# EAGLE schematic DRM-X_voice(control) (EAGLE 7.4.0)
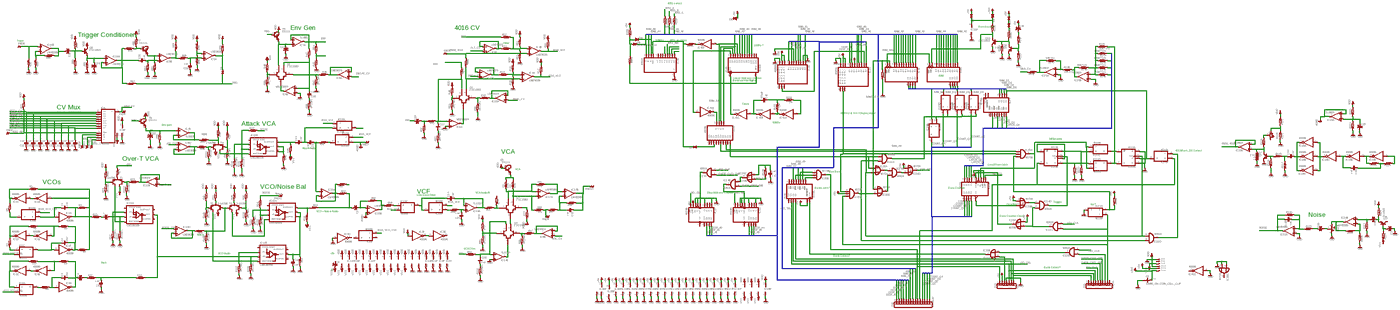
[diagram p0: schematic, sheet 1, overview]
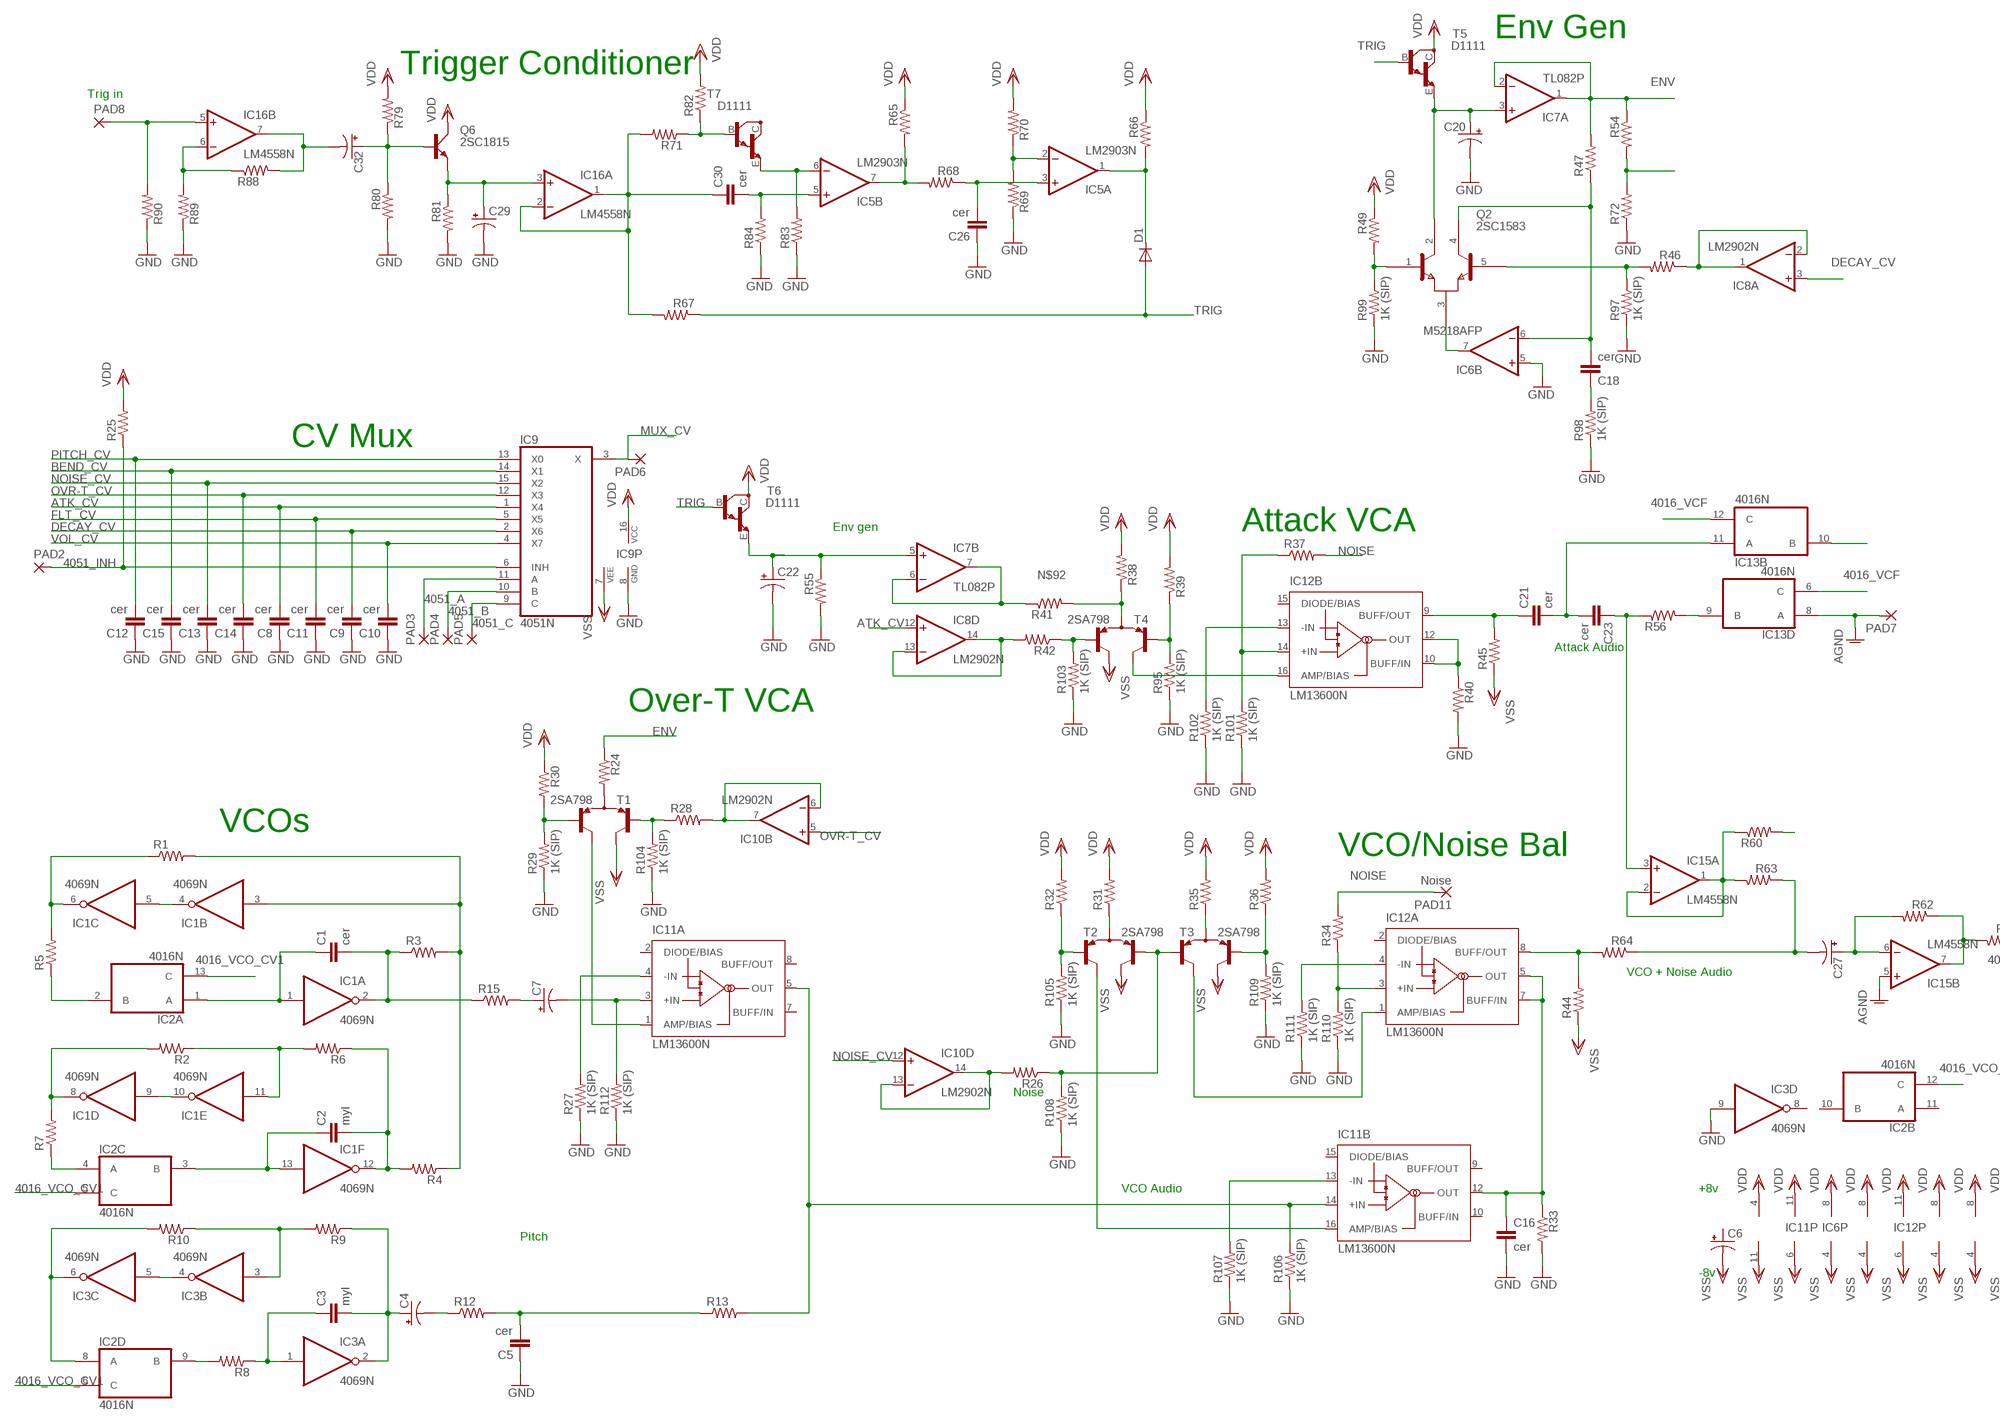
[diagram p1: schematic, sheet 1, part 1 of 4]
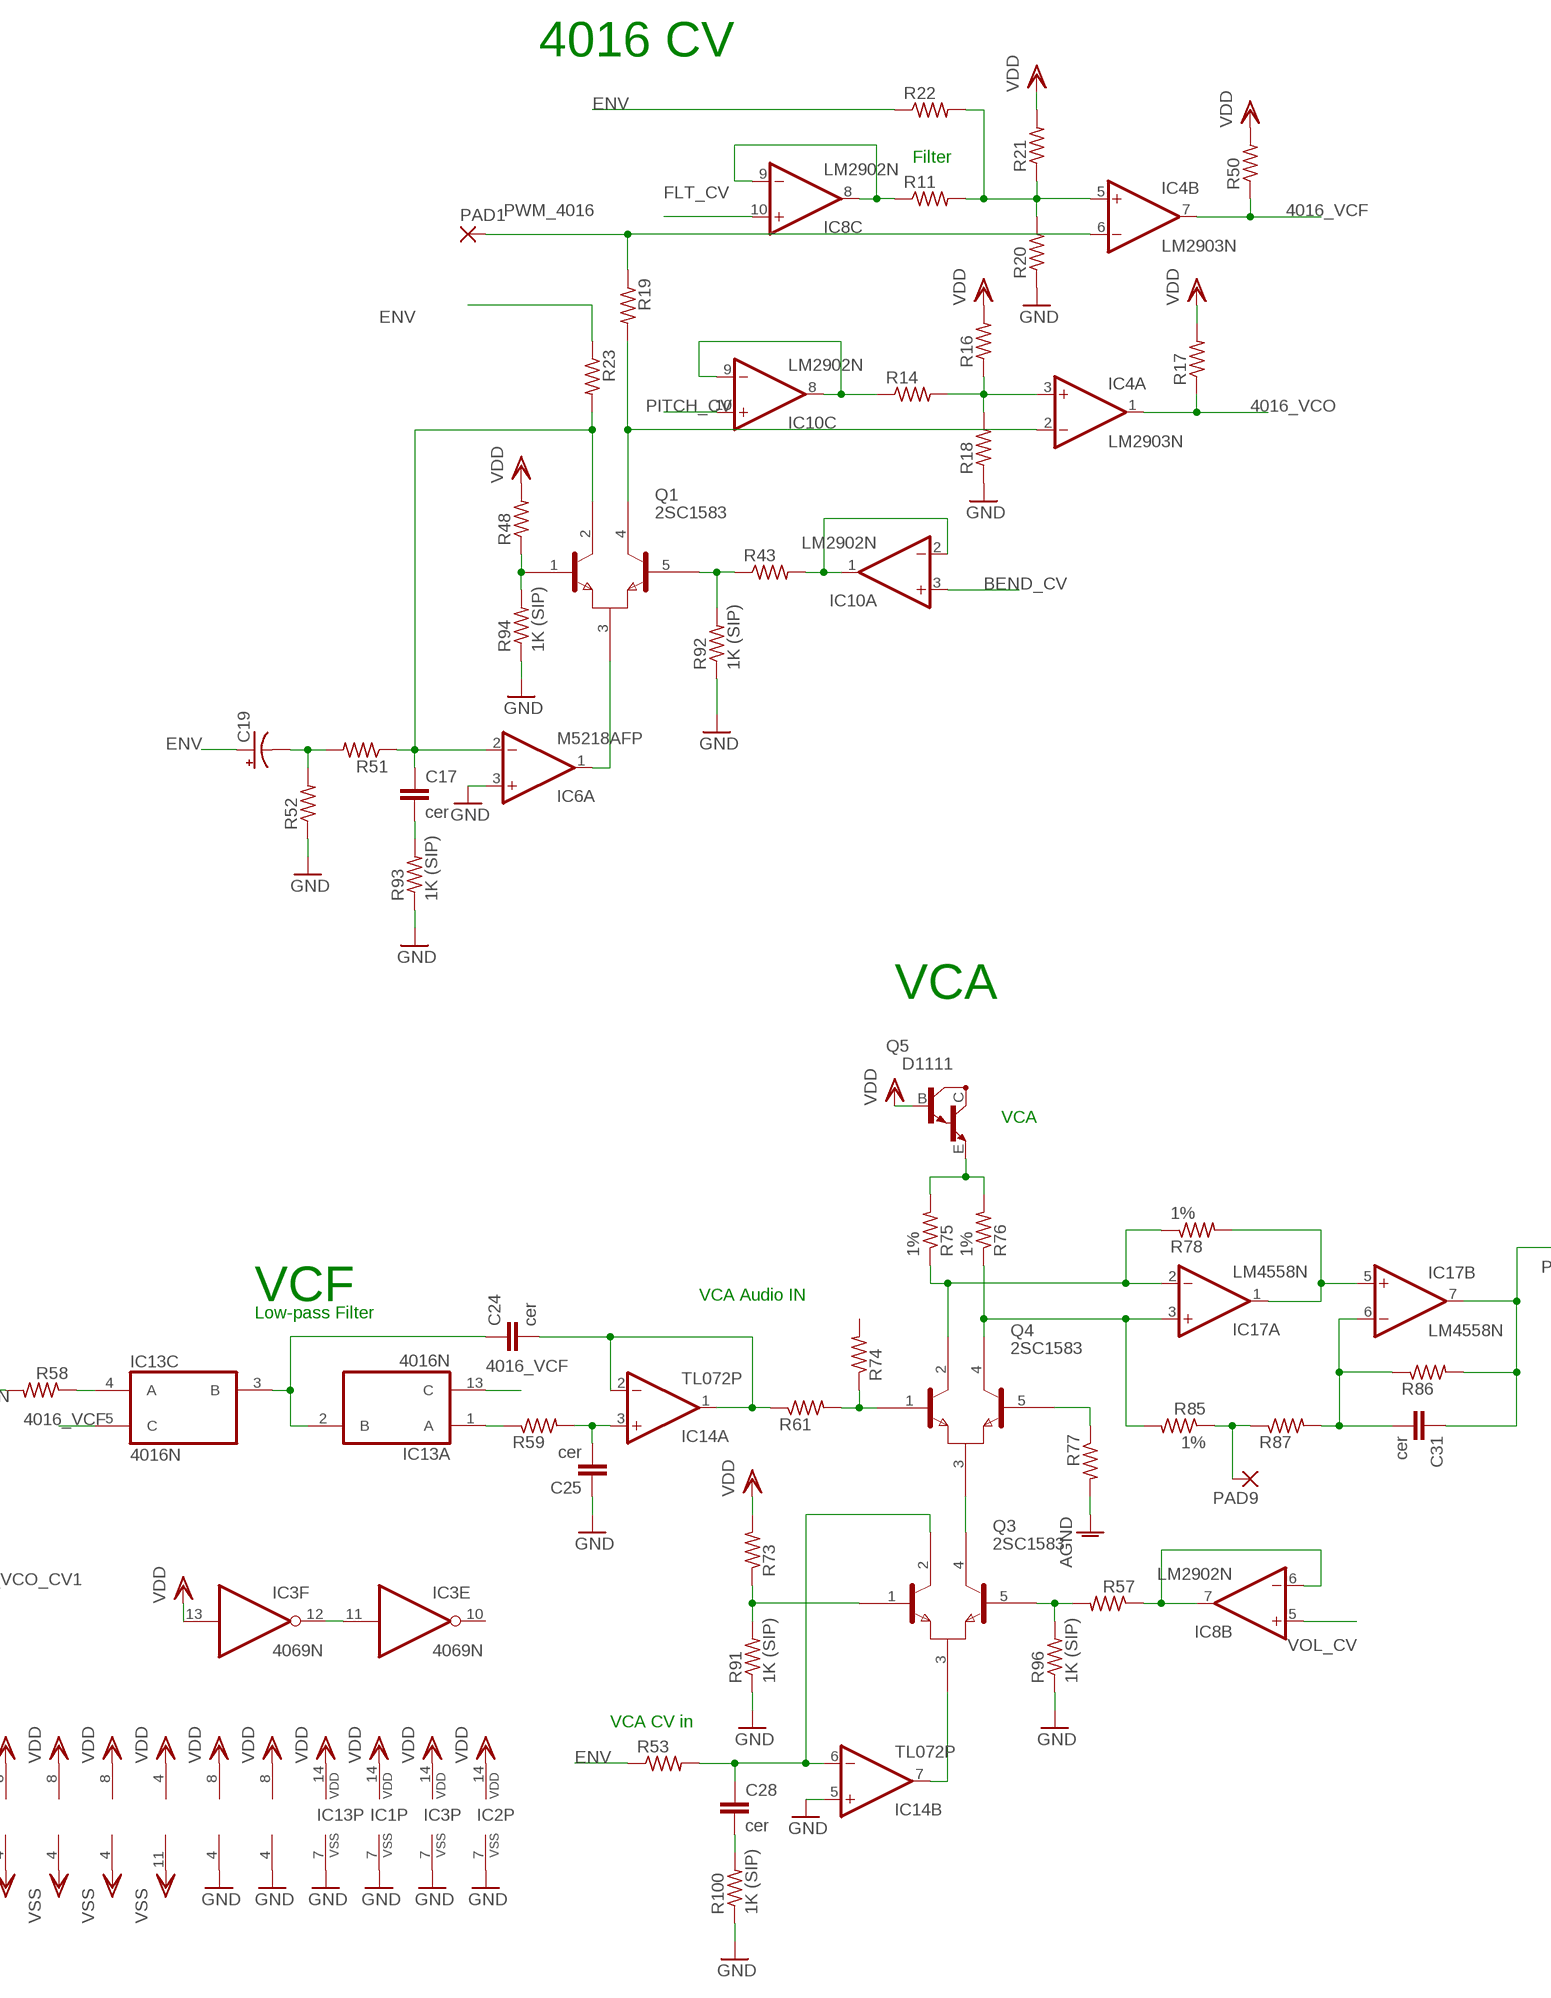
[diagram p2: schematic, sheet 1, part 2 of 4]
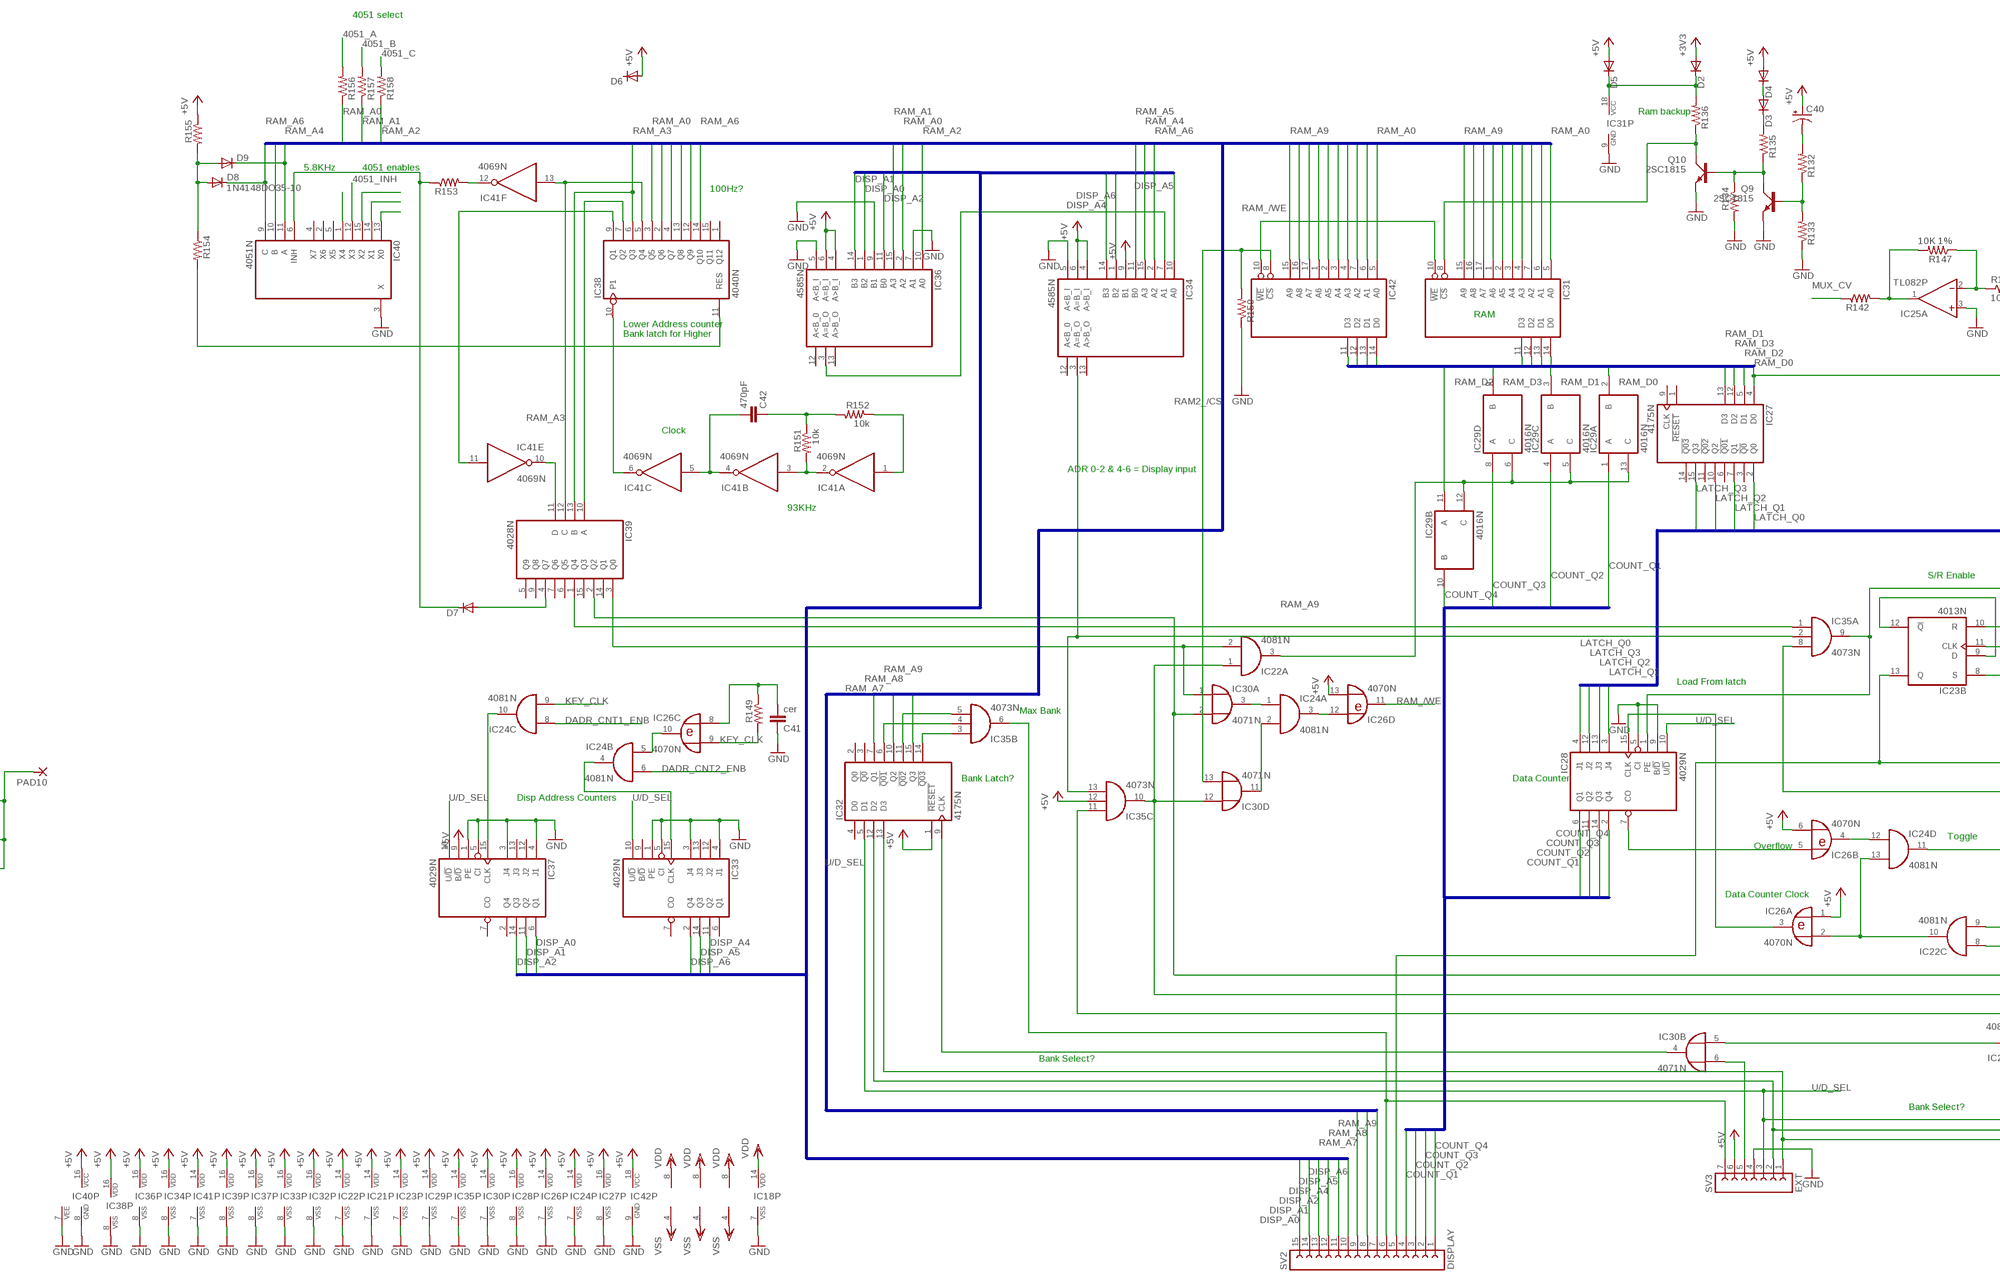
[diagram p3: schematic, sheet 1, part 3 of 4]
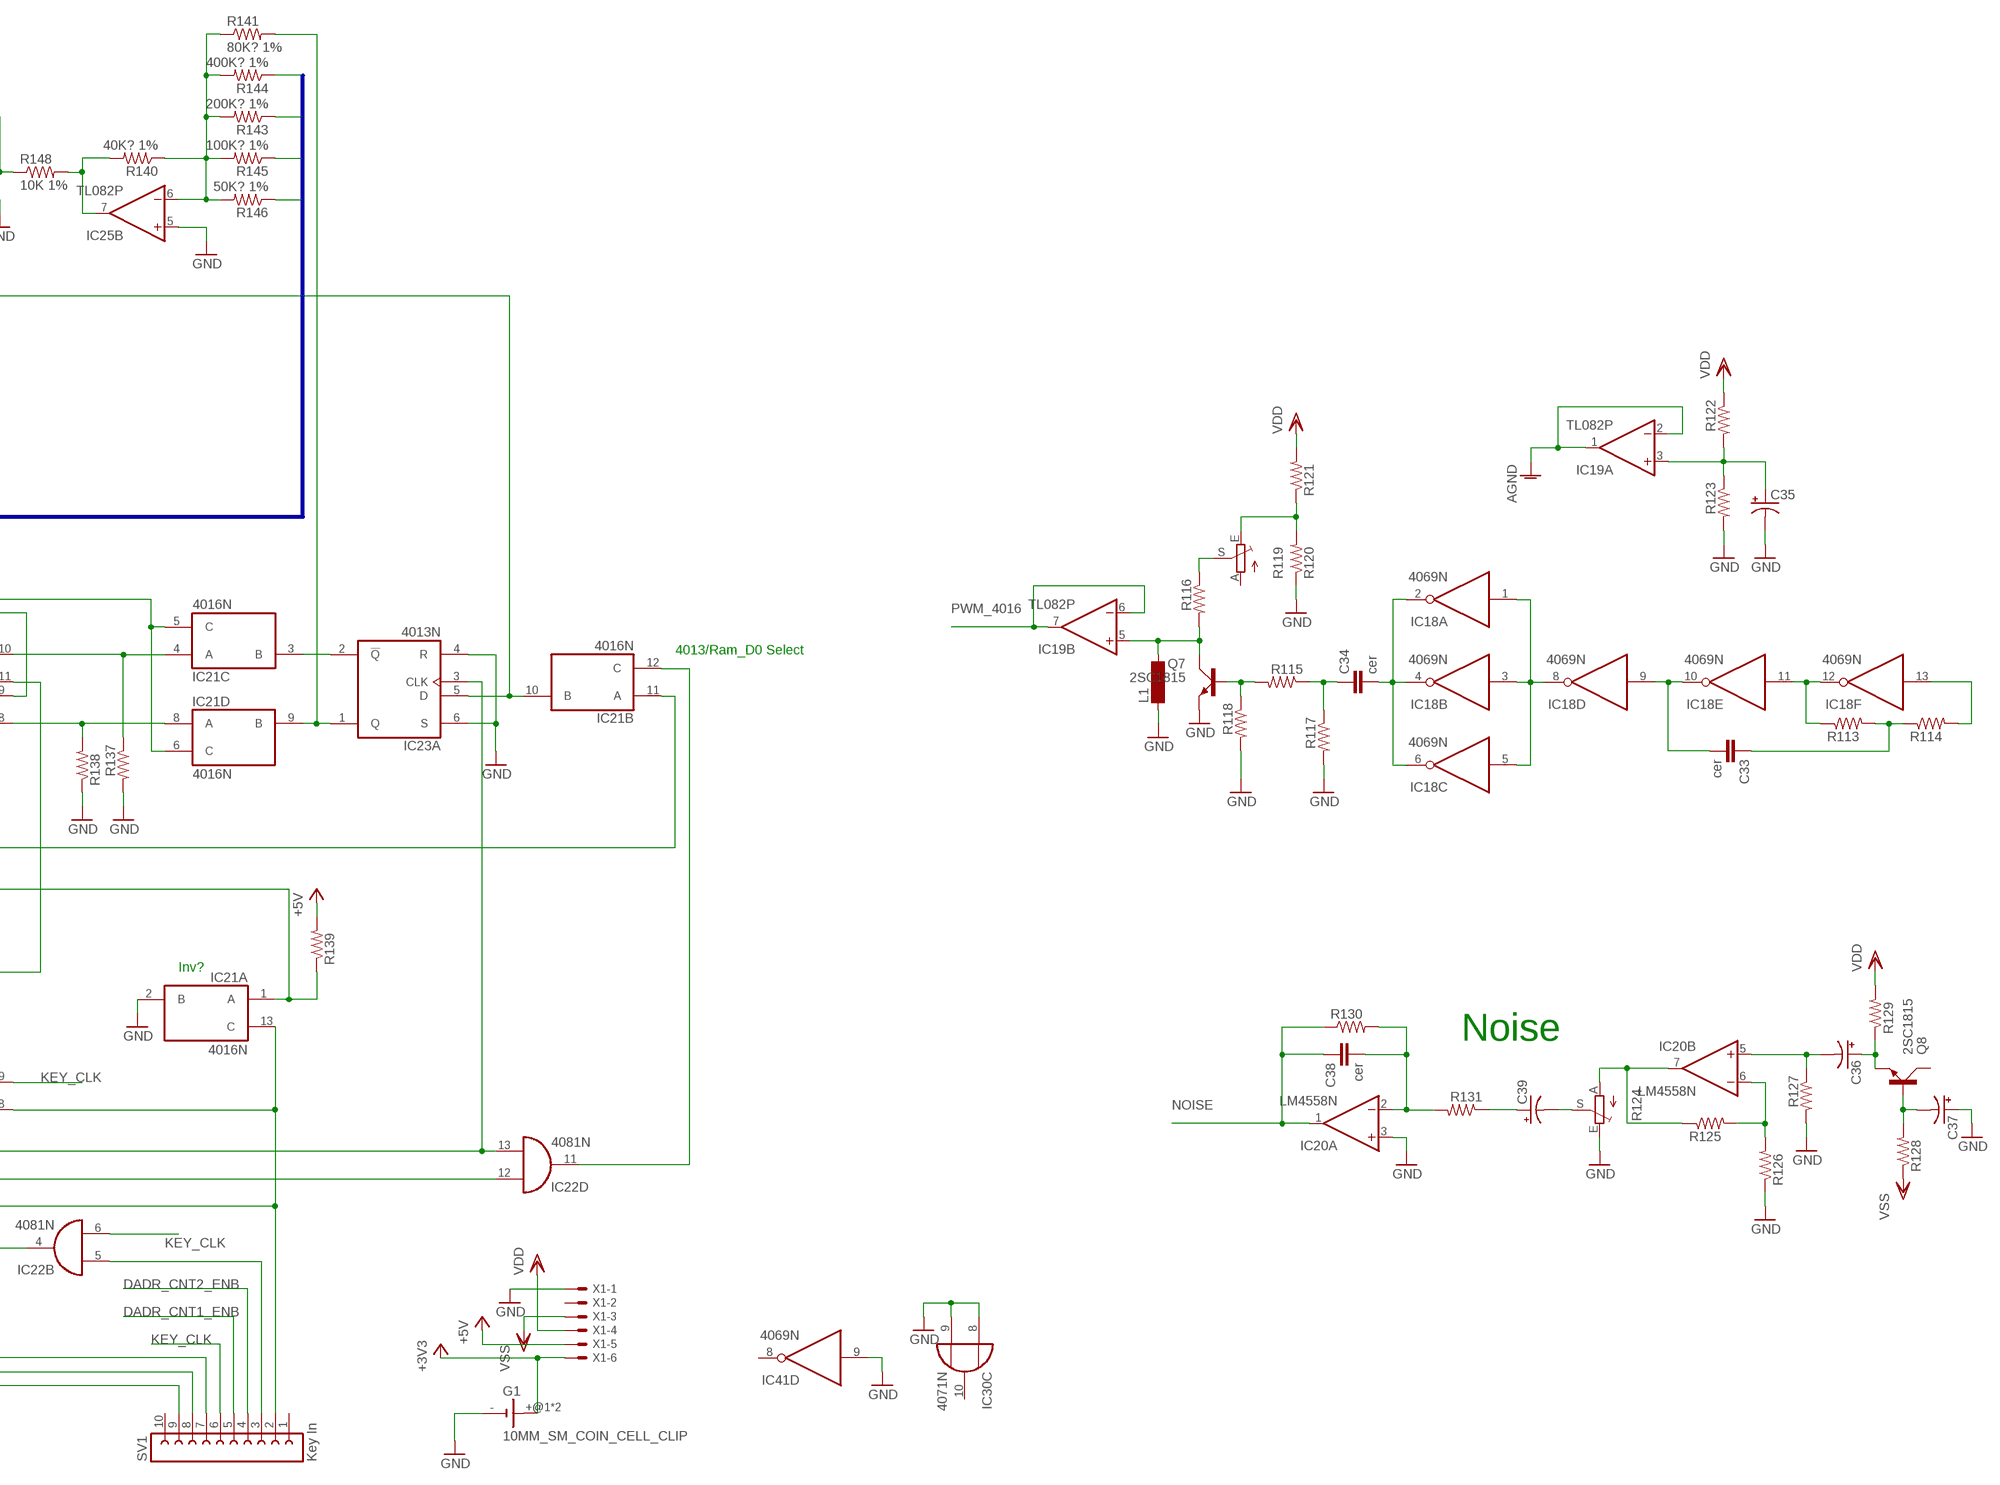
[diagram p4: schematic, sheet 1, part 4 of 4]

## Parts
C1  cer  C-EU025-025X050  [C025-025X050]
C2  myl  C-EU025-024X044  [C025-024X044]
C3  myl  C-EU025-024X044  [C025-024X044]
C4  CPOL-USE2.5-5  [E2,5-5]
C5  cer  C-EU025-025X050  [C025-025X050]
C6  CPOL-USE2.5-7  [E2,5-7]
C7  CPOL-USE2.5-5  [E2,5-5]
C8  cer  C-EU025-025X050  [C025-025X050]
C9  cer  C-EU025-025X050  [C025-025X050]
C10  cer  C-EU025-025X050  [C025-025X050]
C11  cer  C-EU025-025X050  [C025-025X050]
C12  cer  C-EU025-025X050  [C025-025X050]
C13  cer  C-EU025-025X050  [C025-025X050]
C14  cer  C-EU025-025X050  [C025-025X050]
C15  cer  C-EU025-025X050  [C025-025X050]
C16  cer  C-EU025-025X050  [C025-025X050]
C17  cer  C-EU025-025X050  [C025-025X050]
C18  cer  C-EU025-025X050  [C025-025X050]
C19  CPOL-USE2.5-5  [E2,5-5]
C20  CPOL-USE2.5-5  [E2,5-5]
C21  cer  C-EU025-025X050  [C025-025X050]
C22  CPOL-USE2.5-5  [E2,5-5]
C23  cer  C-EU025-025X050  [C025-025X050]
C24  cer  C-EU025-025X050  [C025-025X050]
C25  cer  C-EU025-025X050  [C025-025X050]
C26  cer  C-EU025-025X050  [C025-025X050]
C27  CPOL-USE2.5-5  [E2,5-5]
C28  cer  C-EU025-025X050  [C025-025X050]
C29  CPOL-USE2.5-5  [E2,5-5]
C30  cer  C-EU025-025X050  [C025-025X050]
C31  cer  C-EU025-025X050  [C025-025X050]
C32  CPOL-USE2.5-5  [E2,5-5]
C33  cer  C-EU025-025X050  [C025-025X050]
C34  cer  C-EU025-025X050  [C025-025X050]
C35  CPOL-USE2.5-5  [E2,5-5]
C36  CPOL-USE2.5-5  [E2,5-5]
C37  CPOL-USE2.5-5  [E2,5-5]
C38  cer  C-EU025-025X050  [C025-025X050]
C39  CPOL-USE2.5-5  [E2,5-5]
C40  CPOL-USE2.5-5  [E2,5-5]
C41  cer  C-EU025-025X050  [C025-025X050]
C42  470pF  C-EU025-025X050  [C025-025X050]
D1  DIODE-D-5  [D-5]
D2  DIODE-D-5  [D-5]
D3  DIODE-D-5  [D-5]
D4  DIODE-D-5  [D-5]
D5  DIODE-D-5  [D-5]
D6  DIODE-D-5  [D-5]
D7  DIODE-D-5  [D-5]
D8  1N4148DO35-10  [DO35-10]
D9  DIODE-D-5  [D-5]
G1  10MM_SM_COIN_CELL_CLIP  [10MM_SM_COIN_CELL_CLIP]
IC1  4069N  [DIL14]
IC2  4016N  [DIL14]
IC3  4069N  [DIL14]
IC4  LM2903N  [DIL08]
IC5  LM2903N  [DIL08]
IC6  M5218AFP  [SOP8]
IC7  TL082P  [DIL08]
IC8  LM2902N  [DIL14]
IC9  4051N  [DIL16]
IC10  LM2902N  [DIL14]
IC11  LM13600N  [DIL16]
IC12  LM13600N  [DIL16]
IC13  4016N  [DIL14]
IC14  TL072P  [DIL08]
IC15  LM4558N  [DIL08]
IC16  LM4558N  [DIL08]
IC17  LM4558N  [DIL08]
IC18  4069N  [DIL14]
IC19  TL082P  [DIL08]
IC20  LM4558N  [DIL08]
IC21  4016N  [DIL14]
IC22  4081N  [DIL14]
IC23  4013N  [DIL14]
IC24  4081N  [DIL14]
IC25  TL082P  [DIL08]
IC26  4070N  [DIL14]
IC27  4175N  [DIL16]
IC28  4029N  [DIL16]
IC29  4016N  [DIL14]
IC30  4071N  [DIL14]
IC31  2114  [DIL18]
IC32  4175N  [DIL16]
IC33  4029N  [DIL16]
IC34  4585N  [DIL16]
IC35  4073N  [DIL14]
IC36  4585N  [DIL16]
IC37  4029N  [DIL16]
IC38  4040N  [DIL16]
IC39  4028N  [DIL16]
IC40  4051N  [DIL16]
IC41  4069N  [DIL14]
IC42  2114  [DIL18]
L1  SD75  [SD75]
PAD1  2,0/0,9-O  [2,0/0,9-O]
PAD2  2,0/0,9-O  [2,0/0,9-O]
PAD3  2,0/0,9-O  [2,0/0,9-O]
PAD4  2,0/0,9-O  [2,0/0,9-O]
PAD5  2,0/0,9-O  [2,0/0,9-O]
PAD6  2,0/0,9-O  [2,0/0,9-O]
PAD7  2,0/0,9-O  [2,0/0,9-O]
PAD8  2,0/0,9-O  [2,0/0,9-O]
PAD9  2,0/0,9-O  [2,0/0,9-O]
PAD10  2,0/0,9-O  [2,0/0,9-O]
PAD11  Noise  2,0/0,9-O  [2,0/0,9-O]
Q1  2SC1583  [XSIST_SIP5]
Q2  2SC1583  [XSIST_SIP5]
Q3  2SC1583  [XSIST_SIP5]
Q4  2SC1583  [XSIST_SIP5]
Q5  D1111  BC517D1111-ECB  [TO92-ECB]
Q6  2SC1815  [TO92-LINE]
Q7  2SC1815  [TO92-LINE]
Q8  2SC1815  [TO92-LINE]
Q9  2SC1815  [TO92-LINE]
Q10  2SC1815  [TO92-LINE]
R1  R-US_0204/7  [0204/7]
R2  R-US_0204/7  [0204/7]
R3  R-US_0204/7  [0204/7]
R4  R-US_0204/7  [0204/7]
R5  R-US_0204/7  [0204/7]
R6  R-US_0204/7  [0204/7]
R7  R-US_0204/7  [0204/7]
R8  R-US_0204/7  [0204/7]
R9  R-US_0204/7  [0204/7]
R10  R-US_0204/7  [0204/7]
R11  R-US_0204/7  [0204/7]
R12  R-US_0204/7  [0204/7]
R13  R-US_0204/7  [0204/7]
R14  R-US_0204/7  [0204/7]
R15  R-US_0204/7  [0204/7]
R16  R-US_0204/7  [0204/7]
R17  R-US_0204/7  [0204/7]
R18  R-US_0204/7  [0204/7]
R19  R-US_0204/7  [0204/7]
R20  R-US_0204/7  [0204/7]
R21  R-US_0204/7  [0204/7]
R22  R-US_0204/7  [0204/7]
R23  R-US_0204/7  [0204/7]
R24  R-US_0204/7  [0204/7]
R25  R-US_0204/7  [0204/7]
R26  R-US_0204/7  [0204/7]
R27  1K (SIP)  R-US_0204/7  [0204/7]
R28  R-US_0204/7  [0204/7]
R29  1K (SIP)  R-US_0204/7  [0204/7]
R30  R-US_0204/7  [0204/7]
R31  R-US_0204/7  [0204/7]
R32  R-US_0204/7  [0204/7]
R33  R-US_0204/7  [0204/7]
R34  R-US_0204/7  [0204/7]
R35  R-US_0204/7  [0204/7]
R36  R-US_0204/7  [0204/7]
R37  R-US_0204/7  [0204/7]
R38  R-US_0204/7  [0204/7]
R39  R-US_0204/7  [0204/7]
R40  R-US_0204/7  [0204/7]
R41  R-US_0204/7  [0204/7]
R42  R-US_0204/7  [0204/7]
R43  R-US_0204/7  [0204/7]
R44  R-US_0204/7  [0204/7]
R45  R-US_0204/7  [0204/7]
R46  R-US_0204/7  [0204/7]
R47  R-US_0204/7  [0204/7]
R48  R-US_0204/7  [0204/7]
R49  R-US_0204/7  [0204/7]
R50  R-US_0204/7  [0204/7]
R51  R-US_0204/7  [0204/7]
R52  R-US_0204/7  [0204/7]
R53  R-US_0204/7  [0204/7]
R54  R-US_0204/7  [0204/7]
R55  R-US_0204/7  [0204/7]
R56  R-US_0204/7  [0204/7]
R57  R-US_0204/7  [0204/7]
R58  R-US_0204/7  [0204/7]
R59  R-US_0204/7  [0204/7]
R60  R-US_0204/7  [0204/7]
R61  R-US_0204/7  [0204/7]
R62  R-US_0204/7  [0204/7]
R63  R-US_0204/7  [0204/7]
R64  R-US_0204/7  [0204/7]
R65  R-US_0204/7  [0204/7]
R66  R-US_0204/7  [0204/7]
R67  R-US_0204/7  [0204/7]
R68  R-US_0204/7  [0204/7]
R69  R-US_0204/7  [0204/7]
R70  R-US_0204/7  [0204/7]
R71  R-US_0204/7  [0204/7]
R72  R-US_0204/7  [0204/7]
R73  R-US_0204/7  [0204/7]
R74  R-US_0204/7  [0204/7]
R75  1%  R-US_0204/7  [0204/7]
R76  1%  R-US_0204/7  [0204/7]
R77  R-US_0204/7  [0204/7]
R78  1%  R-US_0204/7  [0204/7]
R79  R-US_0204/7  [0204/7]
R80  R-US_0204/7  [0204/7]
R81  R-US_0204/7  [0204/7]
R82  R-US_0204/7  [0204/7]
R83  R-US_0204/7  [0204/7]
R84  R-US_0204/7  [0204/7]
R85  1%  R-US_0204/7  [0204/7]
R86  R-US_0204/7  [0204/7]
R87  R-US_0204/7  [0204/7]
R88  R-US_0204/7  [0204/7]
R89  R-US_0204/7  [0204/7]
R90  R-US_0204/7  [0204/7]
R91  1K (SIP)  R-US_0204/7  [0204/7]
R92  1K (SIP)  R-US_0204/7  [0204/7]
R93  1K (SIP)  R-US_0204/7  [0204/7]
R94  1K (SIP)  R-US_0204/7  [0204/7]
R95  1K (SIP)  R-US_0204/7  [0204/7]
R96  1K (SIP)  R-US_0204/7  [0204/7]
R97  1K (SIP)  R-US_0204/7  [0204/7]
R98  1K (SIP)  R-US_0204/7  [0204/7]
R99  1K (SIP)  R-US_0204/7  [0204/7]
R100  1K (SIP)  R-US_0204/7  [0204/7]
R101  1K (SIP)  R-US_0204/7  [0204/7]
R102  1K (SIP)  R-US_0204/7  [0204/7]
R103  1K (SIP)  R-US_0204/7  [0204/7]
R104  1K (SIP)  R-US_0204/7  [0204/7]
R105  1K (SIP)  R-US_0204/7  [0204/7]
R106  1K (SIP)  R-US_0204/7  [0204/7]
R107  1K (SIP)  R-US_0204/7  [0204/7]
R108  1K (SIP)  R-US_0204/7  [0204/7]
R109  1K (SIP)  R-US_0204/7  [0204/7]
R110  1K (SIP)  R-US_0204/7  [0204/7]
R111  1K (SIP)  R-US_0204/7  [0204/7]
R112  1K (SIP)  R-US_0204/7  [0204/7]
R113  R-US_0204/7  [0204/7]
R114  R-US_0204/7  [0204/7]
R115  R-US_0204/7  [0204/7]
R116  R-US_0204/7  [0204/7]
R117  R-US_0204/7  [0204/7]
R118  R-US_0204/7  [0204/7]
R119  TRIM_EU-CA6V  [CA6V]
R120  R-US_0204/7  [0204/7]
R121  R-US_0204/7  [0204/7]
R122  R-US_0204/7  [0204/7]
R123  R-US_0204/7  [0204/7]
R124  TRIM_EU-CA6V  [CA6V]
R125  R-US_0204/7  [0204/7]
R126  R-US_0204/7  [0204/7]
R127  R-US_0204/7  [0204/7]
R128  R-US_0204/7  [0204/7]
R129  R-US_0204/7  [0204/7]
R130  R-US_0204/7  [0204/7]
R131  R-US_0204/7  [0204/7]
R132  R-US_0204/7  [0204/7]
R133  R-US_0204/7  [0204/7]
R134  R-US_0204/7  [0204/7]
R135  R-US_0204/7  [0204/7]
R136  R-US_0204/7  [0204/7]
R137  R-US_0204/7  [0204/7]
R138  R-US_0204/7  [0204/7]
R139  R-US_0204/7  [0204/7]
R140  40K? 1%  R-US_0204/5  [0204/5]
R141  80K? 1%  R-US_0204/5  [0204/5]
R142  R-US_0204/7  [0204/7]
R143  200K? 1%  R-US_0204/5  [0204/5]
R144  400K? 1%  R-US_0204/5  [0204/5]
R145  100K? 1%  R-US_0204/5  [0204/5]
R146  50K? 1%  R-US_0204/5  [0204/5]
R147  10K 1%  R-US_0204/5  [0204/5]
R148  10K 1%  R-US_0204/5  [0204/5]
R149  R-US_0204/7  [0204/7]
R150  R-US_0204/7  [0204/7]
R151  10k  R-US_0204/7  [0204/7]
R152  10k  R-US_0204/7  [0204/7]
R153  R-US_0204/7  [0204/7]
R154  R-US_0204/2V  [0204V]
R155  R-US_0204/7  [0204/7]
R156  R-US_0204/7  [0204/7]
R157  R-US_0204/7  [0204/7]
R158  R-US_0204/7  [0204/7]
SV1  Key In  FE10-1  [FE10]
SV2  DISPLAY  FE15-1  [FE15]
SV3  EXT  FE07-1  [FE07]
T1  2SA798  [SIP-5]
T2  2SA798  [SIP-5]
T3  2SA798  [SIP-5]
T4  2SA798  [SIP-5]
T5  D1111  BC517D1111-ECB  [TO92-ECB]
T6  D1111  BC517D1111-ECB  [TO92-ECB]
T7  D1111  BC517D1111-ECB  [TO92-ECB]
X1  KK-156-6  [KK-156-6]

## Nets
4016_VCF: IC4.7(B:OUT) IC13.5(C:C) IC13.6(D:C) IC13.12(B:C) IC13.13(A:C) R50.1
4016_VCO: IC4.1(A:OUT) R17.1
4016_VCO_CV1: IC2.5(C:C) IC2.6(D:C) IC2.12(B:C) IC2.13(A:C)
4051_A: IC9.11(A) PAD3.1(P) R156.2
4051_B: IC9.10(B) PAD4.1(P) R157.2
4051_C: IC9.9(C) PAD5.1(P) R158.2
4051_INH: IC9.6(INH) IC40.12(X3) PAD2.1(P) R25.1
+3V3: D2.A G1.+@1(+) G1.+@2(+) X1.6
+5V: C40.+ D4.A D5.A D6.A IC21.14(P:VDD) IC22.14(P:VDD) IC23.14(P:VDD) IC24.14(P:VDD) IC26.1(A:I0) IC26.6(B:I1) IC26.13(D:I1) IC26.14(P:VDD) IC27.16(VDD) IC28.16(VDD) IC29.14(P:VDD) IC30.14(P:VDD) IC32.1(!RESET) IC32.16(VDD) IC33.16(VDD) IC34.4(A>B_I) IC34.6(A=B_I) IC34.9(B1) IC34.16(VDD) IC35.12(C:I1) IC35.14(P:VDD) IC36.4(A>B_I) IC36.6(A=B_I) IC36.16(VDD) IC37.9(B/!D) IC37.16(VDD) IC38.16(VDD) IC39.16(VDD) IC40.16(VCC) IC41.14(P:VDD) IC42.18(VCC) R139.2 R155.1 SV3.6 X1.5
AGND: IC13.8(D:A) IC15.5(B:+IN) IC19.1(A:OUT) IC19.2(A:-IN) PAD7.1(P) R77.2
ATK_CV: C8.2 IC8.12(D:+IN) IC9.1(X4)
BEND_CV: C15.2 IC9.14(X1) IC10.3(A:+IN)
COUNT_Q1: IC28.6(Q1) IC29.1(A:A) SV2.4
COUNT_Q2: IC28.11(Q2) IC29.4(C:A) SV2.3
COUNT_Q3: IC28.14(Q3) IC29.8(D:A) SV2.2
COUNT_Q4: IC28.2(Q4) IC29.10(B:B) SV2.1
DADR_CNT1_ENB: IC24.8(C:I0) SV1.5
DADR_CNT2_ENB: IC24.6(B:I1) SV1.4
DECAY_CV: C9.2 IC8.3(A:+IN) IC9.2(X6)
DISP_A0: IC36.1(B2) IC37.6(Q1) SV2.15
DISP_A1: IC36.14(B3) IC37.11(Q2) SV2.14
DISP_A2: IC36.11(B0) IC37.14(Q3) SV2.13
DISP_A4: IC33.11(Q2) IC34.14(B3) SV2.12
DISP_A5: IC33.14(Q3) IC34.10(A0) SV2.11
DISP_A6: IC33.2(Q4) IC34.1(B2) SV2.10
ENV: C19.+ IC7.1(A:OUT) IC7.2(A:-IN) R22.1 R23.1 R24.1 R47.2 R53.1 R54.1
FLT_CV: C11.2 IC8.10(C:+IN) IC9.5(X5)
GND: C5.1 C8.1 C9.1 C10.1 C11.1 C12.1 C13.1 C14.1 C15.1 C16.2 C20.- C22.- C25.1 C26.1 C29.- C35.- C37.+ C41.1 G1.- IC1.7(P:VSS) IC2.7(P:VSS) IC3.7(P:VSS) IC3.9(D:I) IC4.4(P:V-) IC5.4(P:V-) IC6.3(A:+IN) IC6.5(B:+IN) IC9.8(GND) IC13.7(P:VSS) IC14.5(B:+IN) IC18.7(P:VSS) IC20.3(A:+IN) IC21.2(A:B) IC21.7(P:VSS) IC22.7(P:VSS) IC23.4(A:R) IC23.6(A:S) IC23.7(P:VSS) IC24.7(P:VSS) IC25.3(A:+IN) IC25.5(B:+IN) IC26.7(P:VSS) IC27.8(VSS) IC28.5(CI) IC28.8(VSS) IC28.9(B/!D) IC29.7(P:VSS) IC30.7(P:VSS) IC30.8(C:I0) IC30.9(C:I1) IC31.9(GND) IC32.8(VSS) IC33.1(PE) IC33.3(J4) IC33.4(J1) IC33.5(CI) IC33.8(VSS) IC34.5(A<B_I) IC34.8(VSS) IC35.7(P:VSS) IC36.5(A<B_I) IC36.7(A1) IC36.8(VSS) IC36.9(B1) IC37.1(PE) IC37.3(J4) IC37.4(J1) IC37.5(CI) IC37.8(VSS) IC38.8(VSS) IC39.8(VSS) IC40.3(X) IC40.7(VEE) IC40.8(GND) IC41.7(P:VSS) IC41.9(D:I) IC42.9(GND) L1.1 Q7.3(E) Q9.3(E) Q10.3(E) R18.1 R20.1 R27.1 R29.1 R33.2 R40.2 R52.1 R55.2 R69.1 R72.1 R80.2 R81.2 R83.1 R84.1 R89.1 R90.1 R91.1 R92.1 R93.1 R94.1 R95.1 R96.1 R97.1 R98.1 R99.1 R100.1 R101.1 R102.1 R103.1 R104.1 R105.1 R106.1 R107.1 R108.1 R109.1 R110.1 R111.1 R112.1 R117.2 R118.2 R120.1 R123.2 R124.E R126.1 R127.2 R133.1 R134.2 R137.2 R138.1 R150.1 SV3.4 X1.1
KEY_CLK: IC22.6(B:I1) IC22.9(C:I1) IC24.9(C:I1) IC26.9(C:I1) R149.2 SV1.6
LATCH_Q0: IC27.2(Q0) IC28.4(J1) R146.1
LATCH_Q1: IC27.7(Q1) IC28.3(J4) R145.1
LATCH_Q2: IC27.10(Q2) IC28.13(J3) R143.1
LATCH_Q3: IC27.15(Q3) IC28.12(J2) R144.1
MUX_CV: IC9.3(X) PAD6.1(P) R142.1
N$1: IC1.4(B:O) IC1.5(C:I)
N$2: IC1.6(C:O) R1.1 R5.2
N$3: C1.1 IC1.1(A:I) IC2.1(A:A)
N$4: C1.2 IC1.2(A:O) R3.1 R15.1
N$5: IC1.8(D:O) R2.2 R7.2
N$6: IC1.11(E:I) R2.1 R6.2
N$7: IC1.3(B:I) R1.2 R3.2 R4.1
N$8: IC2.4(C:A) R7.1
N$9: IC1.9(D:I) IC1.10(E:O)
N$10: C2.1 IC1.13(F:I) IC2.3(C:B)
N$11: C2.2 IC1.12(F:O) R4.2 R6.1
N$12: C3.2 C4.+ IC3.2(A:O) R9.1
N$13: C3.1 IC3.1(A:I) R8.1
N$14: C28.1 IC14.6(B:-IN) Q3.2(C1) R53.2
N$15: IC3.3(B:I) R9.2 R10.1
N$16: IC2.2(A:B) R5.1
N$17: IC2.8(D:A) IC3.6(C:O) R10.2
N$18: IC3.4(B:O) IC3.5(C:I)
N$19: IC2.9(D:B) R8.2
N$20: C4.- R12.1
N$21: IC3.11(E:I) IC3.12(F:O)
N$22: C5.2 R12.2 R13.1
N$23: IC10.8(C:OUT) IC10.9(C:-IN) R14.1
N$24: IC10.6(B:-IN) IC10.7(B:OUT) R28.2
N$25: IC10.1(A:OUT) IC10.2(A:-IN) R43.2
N$26: IC10.13(D:-IN) IC10.14(D:OUT) R26.2
N$27: C21.1 IC12.9(B:BUFF/OUT) R45.2
N$28: IC4.3(A:+IN) R14.2 R16.1 R18.2
N$29: IC8.1(A:OUT) IC8.2(A:-IN) R46.1
N$30: IC8.13(D:-IN) IC8.14(D:OUT) R42.2
N$31: IC8.8(C:OUT) IC8.9(C:-IN) R11.1
N$32: IC8.6(B:-IN) IC8.7(B:OUT) R57.1
N$33: IC4.5(B:+IN) R11.2 R20.2 R21.1 R22.2
N$34: C17.1 IC6.2(A:-IN) Q1.2(C1) R23.2 R51.1
N$35: IC13.4(C:A) R58.1
N$36: Q9.1(B) R132.1 R133.2
N$37: IC4.2(A:-IN) Q1.4(C2) R19.2
N$38: C7.+ R15.2
N$39: IC18.13(F:I) R114.2
N$40: C7.- IC11.3(A:+IN) R112.2
N$41: C33.1 R113.2 R114.1
N$42: R24.2 T1.3(E)
N$43: R28.1 R104.2 T1.1(B1)
N$44: R29.2 R30.2 T1.5(B2)
N$45: IC6.1(A:OUT) Q1.3(E)
N$46: IC11.1(A:AMP/BIAS) T1.4(C2)
N$47: C16.1 IC11.12(B:OUT) IC12.5(A:OUT) IC12.7(A:BUFF/IN) R33.1
N$48: IC11.4(A:-IN) R27.2
N$49: D8.A D9.A R154.1 R155.2
N$53: IC38.10(P1) IC41.6(C:O)
N$54: IC11.13(B:-IN) R107.2
N$55: IC18.11(E:I) IC18.12(F:O) R113.1
N$56: R32.1 R105.2 T2.1(B1)
N$57: R26.1 R108.2 T2.5(B2) T3.1(B1)
N$58: R31.1 T2.3(E)
N$59: IC11.16(B:AMP/BIAS) T2.2(C1)
N$60: IC12.3(A:+IN) R34.1 R110.2
N$61: IC12.1(A:AMP/BIAS) T3.2(C1)
N$62: R36.1 R109.2 T3.5(B2)
N$63: R35.1 T3.3(E)
N$64: R39.1 R95.2 T4.1(B1)
N$65: IC12.8(A:BUFF/OUT) R44.2 R64.2
N$66: C33.2 IC18.9(D:I) IC18.10(E:O)
N$67: IC12.4(A:-IN) R111.2
N$68: IC13.9(D:B) R56.2
N$69: R38.1 R41.2 T4.3(E)
N$70: IC12.16(B:AMP/BIAS) T4.2(C1)
N$71: IC12.14(B:+IN) R37.1 R101.2
N$72: IC12.13(B:-IN) R102.2
N$73: R42.1 R103.2 T4.5(B2)
N$74: IC12.10(B:BUFF/IN) IC12.12(B:OUT) R40.1
N$75: Q1.5(B2) R43.1 R92.2
N$76: C17.2 R93.2
N$77: Q2.5(B2) R46.2 R97.2
N$78: Q1.1(B1) R48.1 R94.2
N$79: C18.2 IC6.6(B:-IN) Q2.4(C2) R47.1
N$80: C18.1 R98.2
N$81: Q2.1(B1) R49.2 R99.2
N$82: IC6.7(B:OUT) Q2.3(E)
N$83: C24.1 IC13.2(A:B) IC13.3(C:B)
N$84: Q3.1(B1) R73.1 R91.2
N$85: C21.2 C23.2 IC13.11(B:A)
N$86: C19.- R51.2 R52.2
N$87: C20.+ IC7.3(A:+IN) Q2.2(C1) T5.E
N$88: C34.2 IC18.2(A:O) IC18.4(B:O) IC18.6(C:O)
N$89: IC18.1(A:I) IC18.3(B:I) IC18.5(C:I) IC18.8(D:O)
N$90: C34.1 R115.1 R117.1
N$91: IC19.5(B:+IN) L1.2 Q7.2(C) R116.2
N$92: IC7.6(B:-IN) IC7.7(B:OUT) R41.1
N$93: C23.1 IC15.3(A:+IN) R56.1
N$94: C22.+ IC7.5(B:+IN) R55.1 T6.E
N$95: IC13.1(A:A) R59.1
N$96: C25.2 IC14.3(A:+IN) R59.2
N$97: C24.2 IC14.1(A:OUT) IC14.2(A:-IN) R61.1
N$98: IC15.1(A:OUT) IC15.2(A:-IN) R60.1 R63.2
N$99: IC15.7(B:OUT) R58.2 R62.1
N$100: C27.+ IC15.6(B:-IN) R62.2
N$101: D1.C IC5.1(A:OUT) R66.2
N$103: IC5.7(B:OUT) R65.2 R68.2
N$104: IC5.2(A:-IN) R69.2 R70.1
N$105: PAD9.1(P) R85.1 R87.1
N$106: R54.2 R72.2
N$107: C26.2 IC5.3(A:+IN) R68.1
N$108: C27.- R63.1 R64.1
N$109: IC13.10(B:B)
N$110: C28.2 R100.2
N$111: Q3.4(C2) Q4.3(E)
N$112: Q7.1(B) R115.2 R118.1
N$113: Q4.1(B1) R61.2 R74.1
N$114: C29.+ IC16.3(A:+IN) Q6.3(E) R81.1
N$115: IC17.3(A:+IN) Q4.4(C2) R76.1 R85.2
N$116: Q4.5(B2) R77.1
N$117: IC17.2(A:-IN) Q4.2(C1) R75.1 R78.1
N$118: Q5.E R75.2 R76.2
N$119: IC17.1(A:OUT) IC17.5(B:+IN) R78.2
N$120: C32.+ Q6.1(B) R79.1 R80.1
N$121: IC16.6(B:-IN) R88.1 R89.2
N$122: C30.1 IC16.1(A:OUT) IC16.2(A:-IN) R67.2 R71.2
N$123: R71.1 R82.1 T7.B
N$124: IC5.6(B:-IN) R83.2 T7.E
N$125: C30.2 IC5.5(B:+IN) R84.2
N$126: C32.- IC16.7(B:OUT) R88.2
N$127: IC14.7(B:OUT) Q3.3(E)
N$128: Q3.5(B2) R57.2 R96.2
N$129: R60.2
N$130: IC16.5(B:+IN) PAD8.1(P) R90.2
N$131: R116.1 R119.S
N$132: R119.E R120.2 R121.1
N$133: C35.+ IC19.3(A:+IN) R122.2 R123.1
N$134: C31.2 IC17.6(B:-IN) R86.1 R87.2
N$135: D3.A D4.C
N$136: C31.1 IC17.7(B:OUT) PAD10.1(P) R86.2
N$138: IC20.6(B:-IN) R125.2 R126.2
N$139: D2.C D5.C IC31.18(VCC) R136.2
N$140: C36.- IC20.5(B:+IN) R127.1
N$141: C36.+ Q8.3(E) R129.1
N$142: C37.- Q8.1(B) R128.2
N$143: IC20.7(B:OUT) R124.A R125.1
N$144: C38.2 IC20.2(A:-IN) R130.2 R131.2
N$145: D3.C R135.2
N$146: C39.+ R131.1
N$147: C39.- R124.S
N$148: Q9.2(C) Q10.1(B) R134.1 R135.1
N$149: IC31.8(!CS) Q10.2(C) R136.1
N$150: C40.- R132.2
N$151: IC21.4(C:A) IC23.10(B:R) R137.1
N$153: IC24.5(B:I0) IC26.10(C:O)
N$154: IC22.2(A:I1) IC30.1(A:I0) IC39.3(Q0)
N$155: IC21.8(D:A) IC23.8(B:S) R138.2
N$156: IC24.10(C:O) IC37.15(CLK)
N$157: IC22.13(D:I1) IC23.3(A:CLK) IC30.2(A:I1) IC39.2(Q2)
N$158: IC22.3(A:O) IC29.5(C:C) IC29.6(D:C) IC29.12(B:C) IC29.13(A:C)
N$159: IC21.13(A:C) IC22.8(C:I0) IC35.11(C:I0) SV1.2
N$160: IC21.12(B:C) IC22.11(D:O)
N$161: IC22.5(B:I0) SV1.3
N$162: IC22.4(B:O) IC30.5(B:I0)
N$163: IC22.1(A:I0) IC22.12(D:I0) IC30.12(D:I0) IC35.10(C:O)
N$164: IC24.4(B:O) IC33.15(CLK)
N$165: IC24.1(A:I0) IC30.3(A:O)
N$166: IC24.3(A:O) IC26.12(D:I0)
N$167: IC23.11(B:CLK) IC24.11(D:O)
N$168: IC22.10(C:O) IC24.13(D:I1) IC26.2(A:I1)
N$170: IC21.1(A:A) IC35.8(A:I2) R139.1
N$171: IC21.5(C:C) IC21.6(D:C) IC28.1(PE) IC35.9(A:O)
N$172: IC21.9(D:B) IC23.1(A:Q) R141.2
N$173: IC21.3(C:B) IC23.2(A:!Q)
N$174: IC25.6(B:-IN) R140.1 R141.1 R143.2 R144.2 R145.2 R146.2
N$175: IC38.9(Q1) IC41.11(E:I)
N$176: IC23.9(B:D) IC23.12(B:!Q)
N$177: IC25.7(B:OUT) R140.2 R148.2
N$178: IC25.1(A:OUT) R142.2 R147.2
N$179: IC34.7(A1) IC36.3(A=B_O)
N$180: IC25.2(A:-IN) R147.1 R148.1
N$181: IC21.11(B:A) IC23.13(B:Q) SV2.5
N$183: C41.2 IC26.8(C:I0) R149.1
N$184: C42.1 R151.1 R152.2
N$185: IC41.2(A:O) IC41.3(B:I) R151.2
N$186: IC24.12(D:I0) IC26.4(B:O)
N$187: IC41.12(F:O) R153.2
N$188: IC24.2(A:I1) IC30.11(D:O)
N$189: D7.C IC40.6(INH) R153.1
N$190: IC26.5(B:I0) IC28.7(CO)
N$191: IC38.11(RES) R154.2
N$192: IC26.3(A:O) IC28.15(CLK)
N$193: IC40.15(X2)
N$194: IC40.14(X1)
N$195: IC40.13(X0)
N$196: IC40.1(X4)
N$197: IC32.13(D3) SV1.9 SV3.1
N$199: IC32.12(D2) SV1.8 SV3.2
N$200: IC30.6(B:I1) SV3.5
N$201: IC35.6(B:O) SV2.6 SV3.7
N$202: IC30.4(B:O) IC32.9(CLK)
N$203: IC32.11(!Q02) IC35.5(B:I2)
N$205: IC32.14(!Q03) IC35.3(B:I0)
N$208: IC32.6(!Q01) IC35.4(B:I1)
N$209: IC35.1(A:I0) IC39.1(Q4)
N$210: IC34.3(A=B_O) IC35.2(A:I1) IC35.13(C:I2)
N$217: IC38.7(Q2) IC39.10(A)
N$219: IC41.1(A:I) R152.1
N$220: C42.2 IC41.4(B:O) IC41.5(C:I)
N$221: IC39.11(D) IC41.10(E:O)
N$222: IC38.5(Q4) IC39.12(C) IC41.13(F:I)
N$223: D7.A IC39.4(Q7)
NOISE: C38.1 IC20.1(A:OUT) PAD11.1(P) R34.2 R37.2 R130.1
NOISE_CV: C13.2 IC9.15(X2) IC10.12(D:+IN)
OVR-T_CV: C14.2 IC9.12(X3) IC10.5(B:+IN)
PITCH_CV: C12.2 IC9.13(X0) IC10.10(C:+IN)
PWM_4016: IC4.6(B:-IN) IC19.6(B:-IN) IC19.7(B:OUT) PAD1.1(P) R19.1
RAM2_/CS: IC30.13(D:I1) IC42.8(!CS) R150.2
RAM_/WE: IC26.11(D:O) IC31.10(!WE) IC42.10(!WE)
RAM_A0: IC31.5(A0) IC36.2(A2) IC38.3(Q5) IC42.5(A0) R156.1
RAM_A1: IC31.6(A1) IC36.15(A3) IC38.2(Q6) IC42.6(A1) R157.1
RAM_A2: IC31.7(A2) IC36.10(A0) IC38.4(Q7) IC42.7(A2) R158.1
RAM_A3: IC31.4(A3) IC38.6(Q3) IC39.13(B) IC42.4(A3)
RAM_A4: D9.C IC31.3(A4) IC34.15(A3) IC38.13(Q8) IC40.11(A) IC42.3(A4)
RAM_A5: IC31.2(A5) IC34.11(B0) IC38.12(Q9) IC40.10(B) IC42.2(A5)
RAM_A6: D8.C IC31.1(A6) IC34.2(A2) IC38.14(Q10) IC40.9(C) IC42.1(A6)
RAM_A7: IC31.17(A7) IC32.7(Q1) IC42.17(A7) SV2.9
RAM_A8: IC31.16(A8) IC32.10(Q2) IC42.16(A8) SV2.8
RAM_A9: IC31.15(A9) IC32.15(Q3) IC42.15(A9) SV2.7
RAM_D0: IC21.10(B:B) IC23.5(A:D) IC27.4(D0) IC29.2(A:B) IC31.14(D0) IC42.14(D0)
RAM_D1: IC27.13(D3) IC29.3(C:B) IC31.13(D1) IC42.13(D1)
RAM_D2: IC27.5(D1) IC29.11(B:A) IC31.12(D2) IC42.12(D2)
RAM_D3: IC27.12(D2) IC29.9(D:B) IC31.11(D3) IC42.11(D3)
TRIG: D1.A R67.1 T5.B T6.B
U/D_SEL: IC28.10(U/!D) IC32.5(D1) IC33.10(U/!D) IC37.10(U/!D) SV1.7 SV3.3
VCO_OUT: IC11.5(A:OUT) IC11.14(B:+IN) R13.2 R106.2
VDD: IC1.14(P:VDD) IC2.14(P:VDD) IC3.13(F:I) IC3.14(P:VDD) IC4.8(P:V+) IC5.8(P:V+) IC6.8(P:V+) IC7.8(P:V+) IC8.4(P:V+) IC9.16(VCC) IC10.4(P:V+) IC11.11(P:V+) IC12.11(P:V+) IC13.14(P:VDD) IC14.8(P:V+) IC15.8(P:V+) IC16.8(P:V+) IC17.8(P:V+) IC18.14(P:VDD) IC19.8(P:V+) IC20.8(P:V+) IC25.8(P:V+) Q5.B Q6.2(C) R16.2 R17.2 R21.2 R25.2 R30.1 R31.2 R32.2 R35.2 R36.2 R38.2 R39.2 R48.2 R49.1 R50.2 R65.1 R66.1 R70.2 R73.2 R79.2 R82.2 R121.2 R122.1 R129.2 T5.C T6.C X1.4
VOL_CV: C10.2 IC8.5(B:+IN) IC9.4(X7)
VSS: C6.- IC6.4(P:V-) IC7.4(P:V-) IC8.11(P:V-) IC9.7(VEE) IC10.11(P:V-) IC11.6(P:V-) IC12.6(P:V-) IC14.4(P:V-) IC15.4(P:V-) IC16.4(P:V-) IC17.4(P:V-) IC19.4(P:V-) IC20.4(P:V-) IC25.4(P:V-) R44.1 R45.1 R128.1 T1.2(C1) T2.4(C2) T3.4(C2) T4.4(C2) X1.3
Unconnected: C6.+ D6.C IC2.10(B:B) IC2.11(B:A) IC3.8(D:O) IC3.10(E:O) IC11.2(A:DIODE/BIAS) IC11.7(A:BUFF/IN) IC11.8(A:BUFF/OUT) IC11.9(B:BUFF/OUT) IC11.10(B:BUFF/IN) IC11.15(B:DIODE/BIAS) IC12.2(A:DIODE/BIAS) IC12.15(B:DIODE/BIAS) IC27.1(!RESET) IC27.3(!Q0) IC27.6(!Q01) IC27.9(CLK) IC27.11(!Q02) IC27.14(!Q03) IC30.10(C:O) IC32.2(Q0) IC32.3(!Q0) IC32.4(D0) IC33.6(Q1) IC33.7(CO) IC33.9(B/!D) IC33.12(J2) IC33.13(J3) IC34.12(A<B_0) IC34.13(A>B_O) IC36.12(A<B_0) IC36.13(A>B_O) IC37.2(Q4) IC37.7(CO) IC37.12(J2) IC37.13(J3) IC38.1(Q12) IC38.15(Q11) IC39.5(Q9) IC39.6(Q5) IC39.7(Q6) IC39.9(Q8) IC39.14(Q1) IC39.15(Q3) IC40.2(X6) IC40.4(X7) IC40.5(X5) IC41.8(D:O) Q5.C Q8.2(C) R74.2 R119.A SV1.1 SV1.10 T7.C X1.2

## Buses
RAM_D0,RAM_D1,RAM_D2,RAM_D3
LATCH_Q0,LATCH_Q1,LATCH_Q2,LATCH_Q3
RAM_A9,RAM_A8,RAM_A7,RAM_A6,RAM_A5,RAM_A4,RAM_A3,RAM_A2,RAM_A1,RAM_A0
DISP_A0,DISP_A1,DISP_A2,DISP_A4,DISP_A5,DISP_A6
COUNT_Q[1..4]

## Notes on the sheet
- 4051 select
- Ram backup
- Env Gen | 4016 CV
- Trigger Conditioner
- Trig in | 5.8KHz | 4051 enables
- Filter
- 100Hz?
- RAM
- Lower Address counter
- Bank latch for Higher
- Clock
- CV Mux
- ADR 0-2 & 4-6 = Display input
- 93KHz
- Env gen | Attack VCA
- S/R Enable
- Attack Audio
- 4013/Ram_D0 Select
- VCA
- Over-T VCA
- Load From latch
- VCA
- Max Bank
- VCOs
- VCO/Noise Bal | Bank Latch? | Data Counter
- VCF | VCA Audio IN | Disp Address Counters
- Low-pass Filter
- Toggle
- Overflow | Inv?
- VCO + Noise Audio
- Data Counter Clock | Noise
- Noise
- VCA CV in
- VCO Audio | +8v
- Bank Select?
- Pitch
- Bank Select?
- -8v

## Library data of the parts
C1-C3 C5 C8-C18 C21 C23-C26 C28 C30 C31 C33 C34 C38 C41 C42 = rcl:C-EU: CAPACITOR, European symbol
C4 C6 C7 C19 C20 C22 C27 C29 C32 C35-C37 C39 C40 = rcl:CPOL-US: POLARIZED CAPACITOR, American symbol
D1-D7 D9 = diode:DIODE-: DIODE
D8 = diode:1N4148: DIODE high speed (Philips)
G1 = battery:10MM_SM_COIN_CELL_CLIP: Battery cell clip for CR927 Source: KEYSTONE ELECTRONICS CORP. www.keyelco.com, ASTORIA, N.Y. 11105-2017 PART ANME 10mm SM COIN CELl CLIP DWG NO. 3030
IC1 IC3 IC18 IC41 = 40xx:4069: Hex INVERTER
IC2 IC13 IC21 IC29 = 40xx:4016: Quad bilateral ANALOG SWITCH
IC4 IC5 = linear:LM2903: COMPARATOR
IC6 = mitsubishi-semiconductor:M5218: DUAL LOW-NOISE OPERATIONAL AMPLIFIER (DUAL POWER SUPPLY TYPE) Source: Mitsubishi M5218AL/P/FP
IC7 IC19 IC25 = linear:TL082: OP AMP Data sheet <http://www.ti.com/lit/ds/symlink/tl084a . pdf>; DATA_SHEET: <a href="http://www.ti.com/lit/ds/symlink/tl084a.pdf"> Data sheet </a>
IC8 IC10 = linear:LM2902: Low power quad operational amplifier Source: Data sgeet <http://www.st.com/internet/com/TECHNICAL_RESOURCES/TECHNICAL_LITERATURE/DATASHEET/CD00000533.pdf>
IC9 IC40 = 40xx:4051: 8-channel ANALOG MULTIPLEXER
IC11 IC12 = national-semiconductor:LM13600: Dual Operational Transconductance Amplifiers with Linearizing Diodes and Buffers Source: lm13600.PDF
IC14 = linear:TL072: OP AMP
IC15-IC17 IC20 = linear:*4558: OP AMP
IC22 IC24 = 40xx:4081: Quad 2-input AND
IC23 = 40xx:4013: Dual D FLIP FLOP, set/reset
IC26 = 40xx:4070: Quad 2-input XOR
IC27 IC32 = 40xx:4175: Quad D FLIP FLOP
IC28 IC33 IC37 = 40xx:4029: Binary/decimal up/down COUNTER
IC30 = 40xx:4071: Quad 2-input OR
IC31 IC42 = memory:2114: MEMORY
IC34 IC36 = 45xx:4585: 4-bit COMPARATOR (MC14585BCP)
IC35 = 40xx:4073: Triple 3-input AND
IC38 = 40xx:4040: 12-stage binary/ripple COUNTER
IC39 = 40xx:4028: BCD to decimal DECODER
L1 = inductor-neosid:SD75: INDUCTOR nominal inductance, E12; OC_FARNELL: unknown; OC_NEWARK: unknown
PAD1-PAD11 = synthdiy:2,0/0,9-O: OCT THROUGH-HOLE PAD 2.0 mm, 0.9 mm/0.079",0.035"
Q1-Q4 = synthdiy:2SC1583: Dual low noise NPN TRANSISTOR.
Q5 T5-T7 = transistor:BC517: NPN BIPOLAR DARLINGTON TRANSISTOR
Q6-Q10 = akihabara:2SC1815: 2SC1815 Audio frequency general purpose amplifier. Package ECB. Complementary to 2SA1015
R1-R118 R120-R123 R125-R158 = rcl:R-US_: RESISTOR, American symbol
R119 R124 = pot:TRIM_EU-: POTENTIOMETER
SV1 = con-lsta:FE10-1: FEMALE HEADER; OC_FARNELL: unknown; OC_NEWARK: unknown
SV2 = con-lsta:FE15-1: FEMALE HEADER; OC_FARNELL: unknown; OC_NEWARK: unknown
SV3 = con-lsta:FE07-1: FEMALE HEADER; OC_FARNELL: unknown; OC_NEWARK: unknown
T1-T4 = transistor:2SA798: PNP DIFFERENTAL AMP SIP-5 Source: 2SA798.pdf
X1 = con-molex:KK-156-6: KK 156 HEADER Source: http://www.molex.com/pdm_docs/sd/026604100_sd.pdf; OC_FARNELL: unknown; OC_NEWARK: unknown

## Net classes
1 PWR: width 0.508 mm